# EasyEDA Pro project 51PCB_Project.eprj, board PCB1
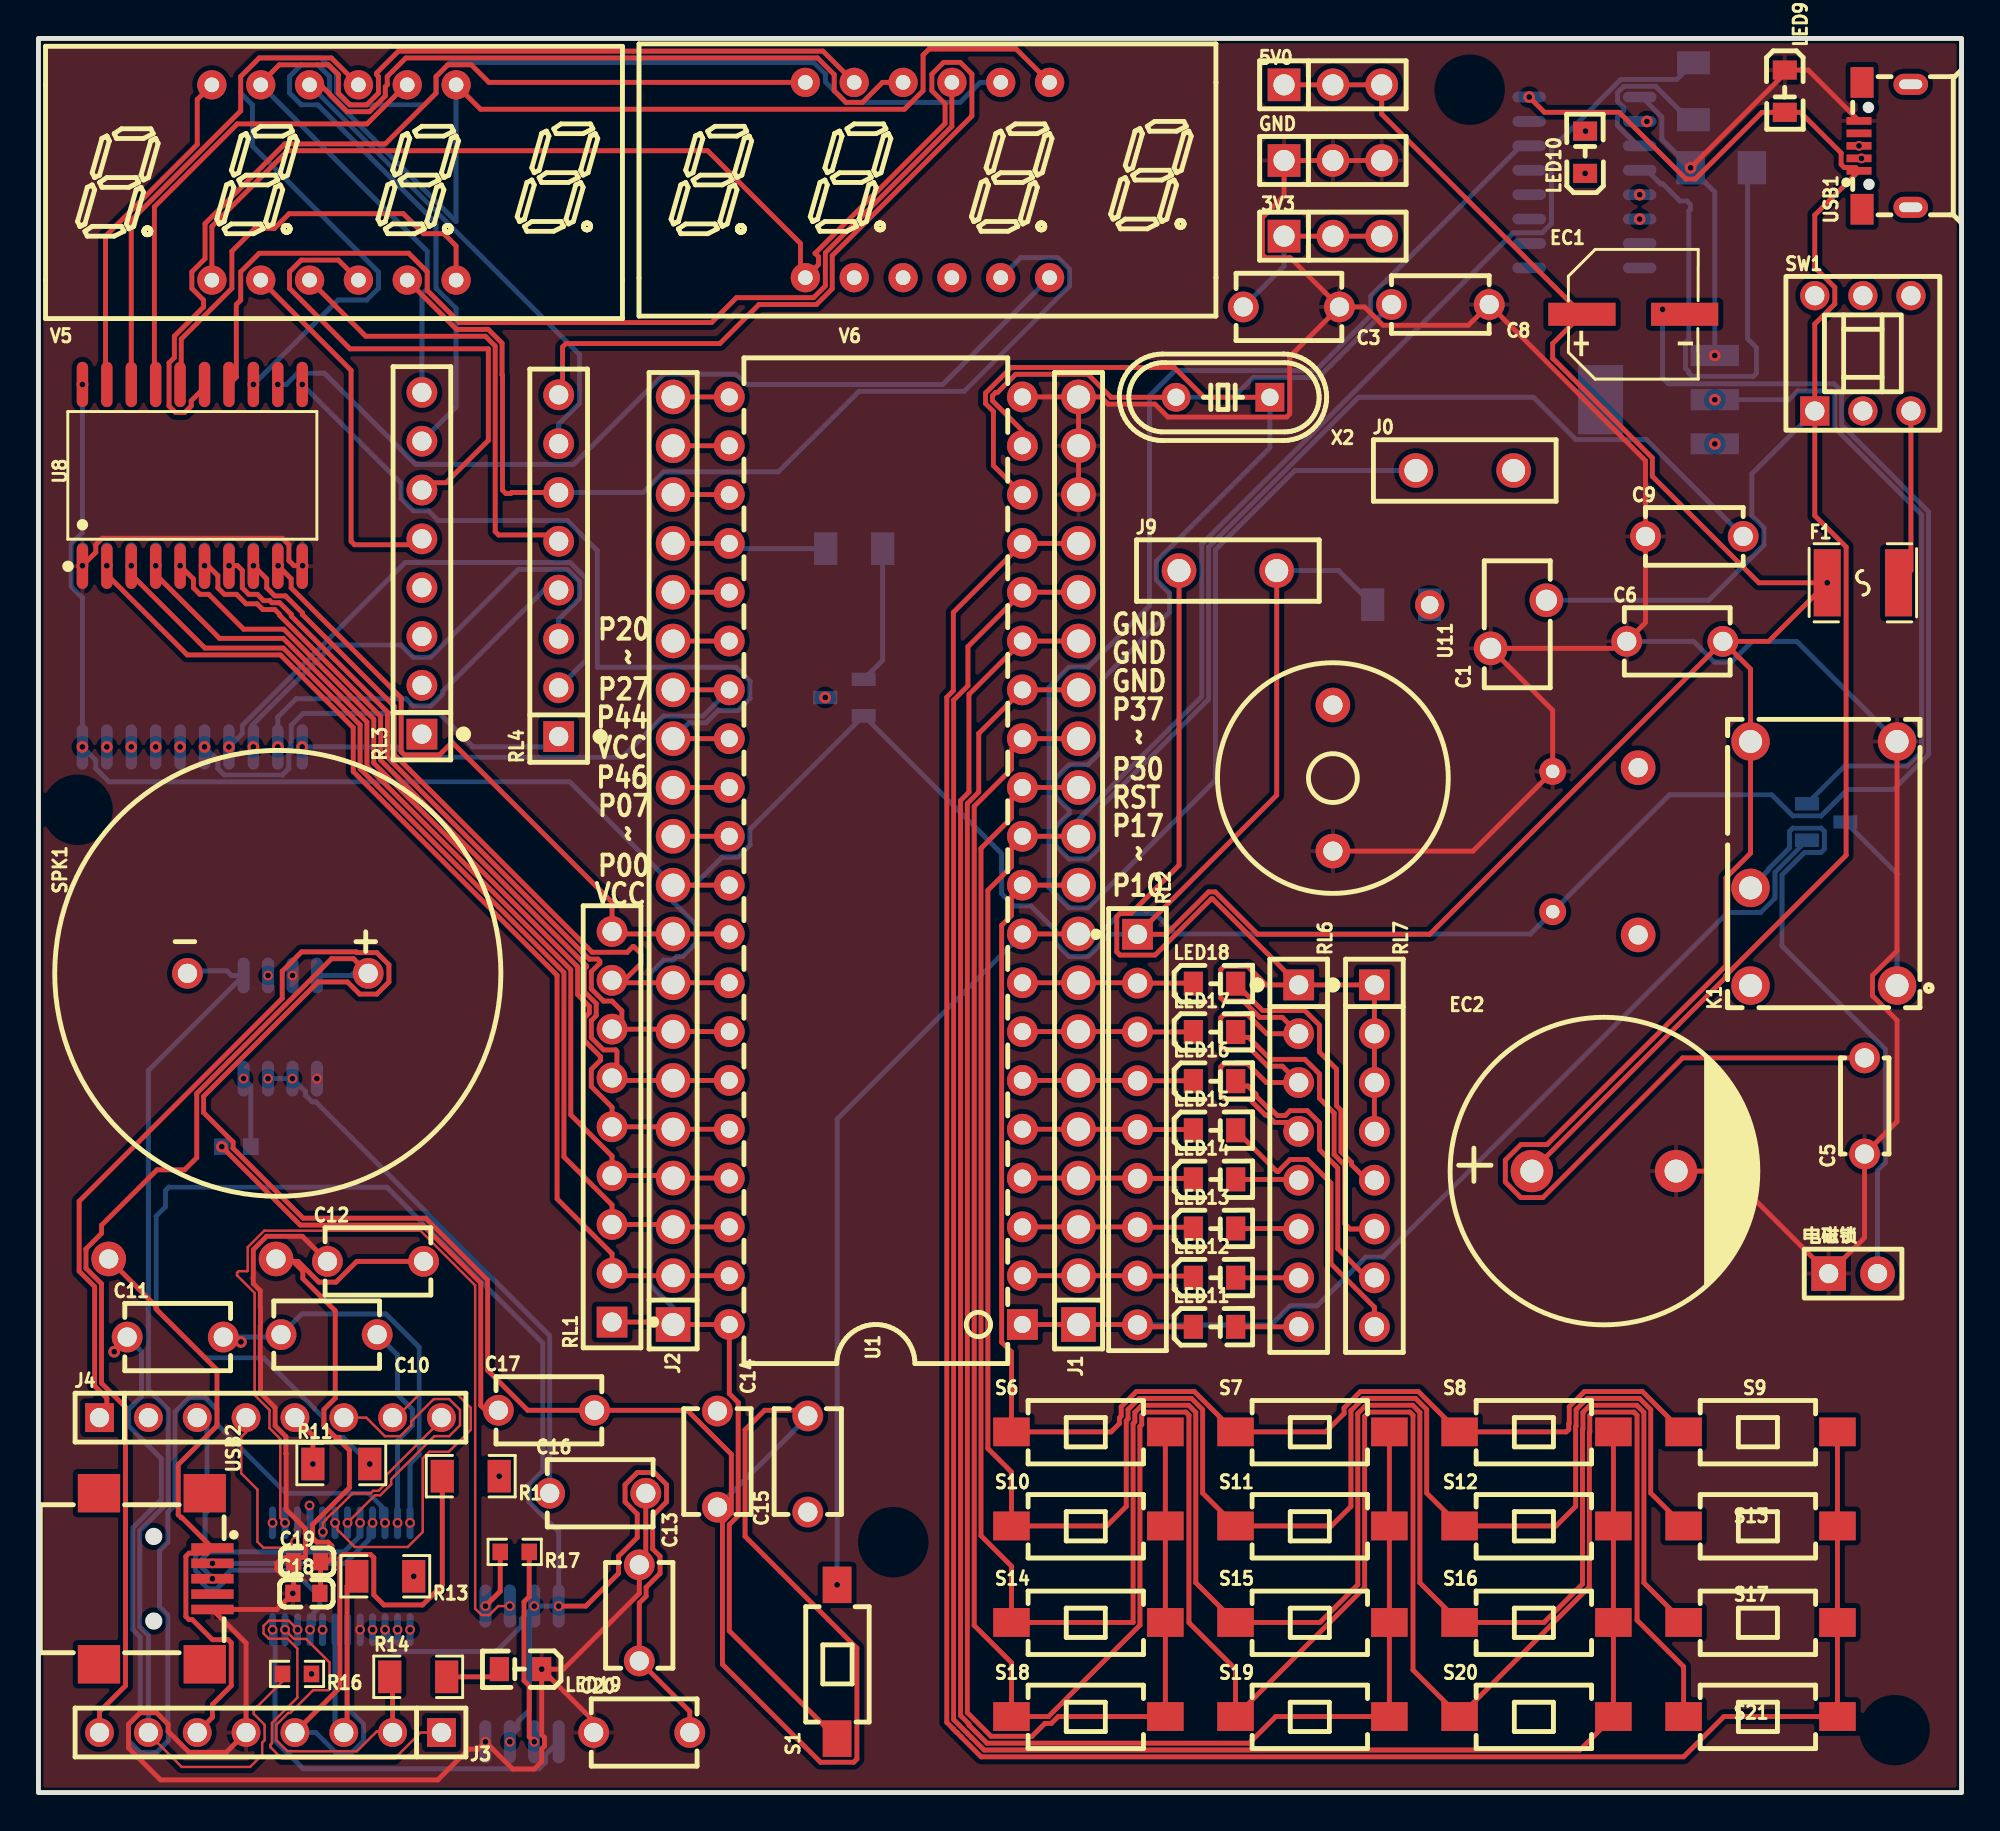
[diagram p1: board, top side]
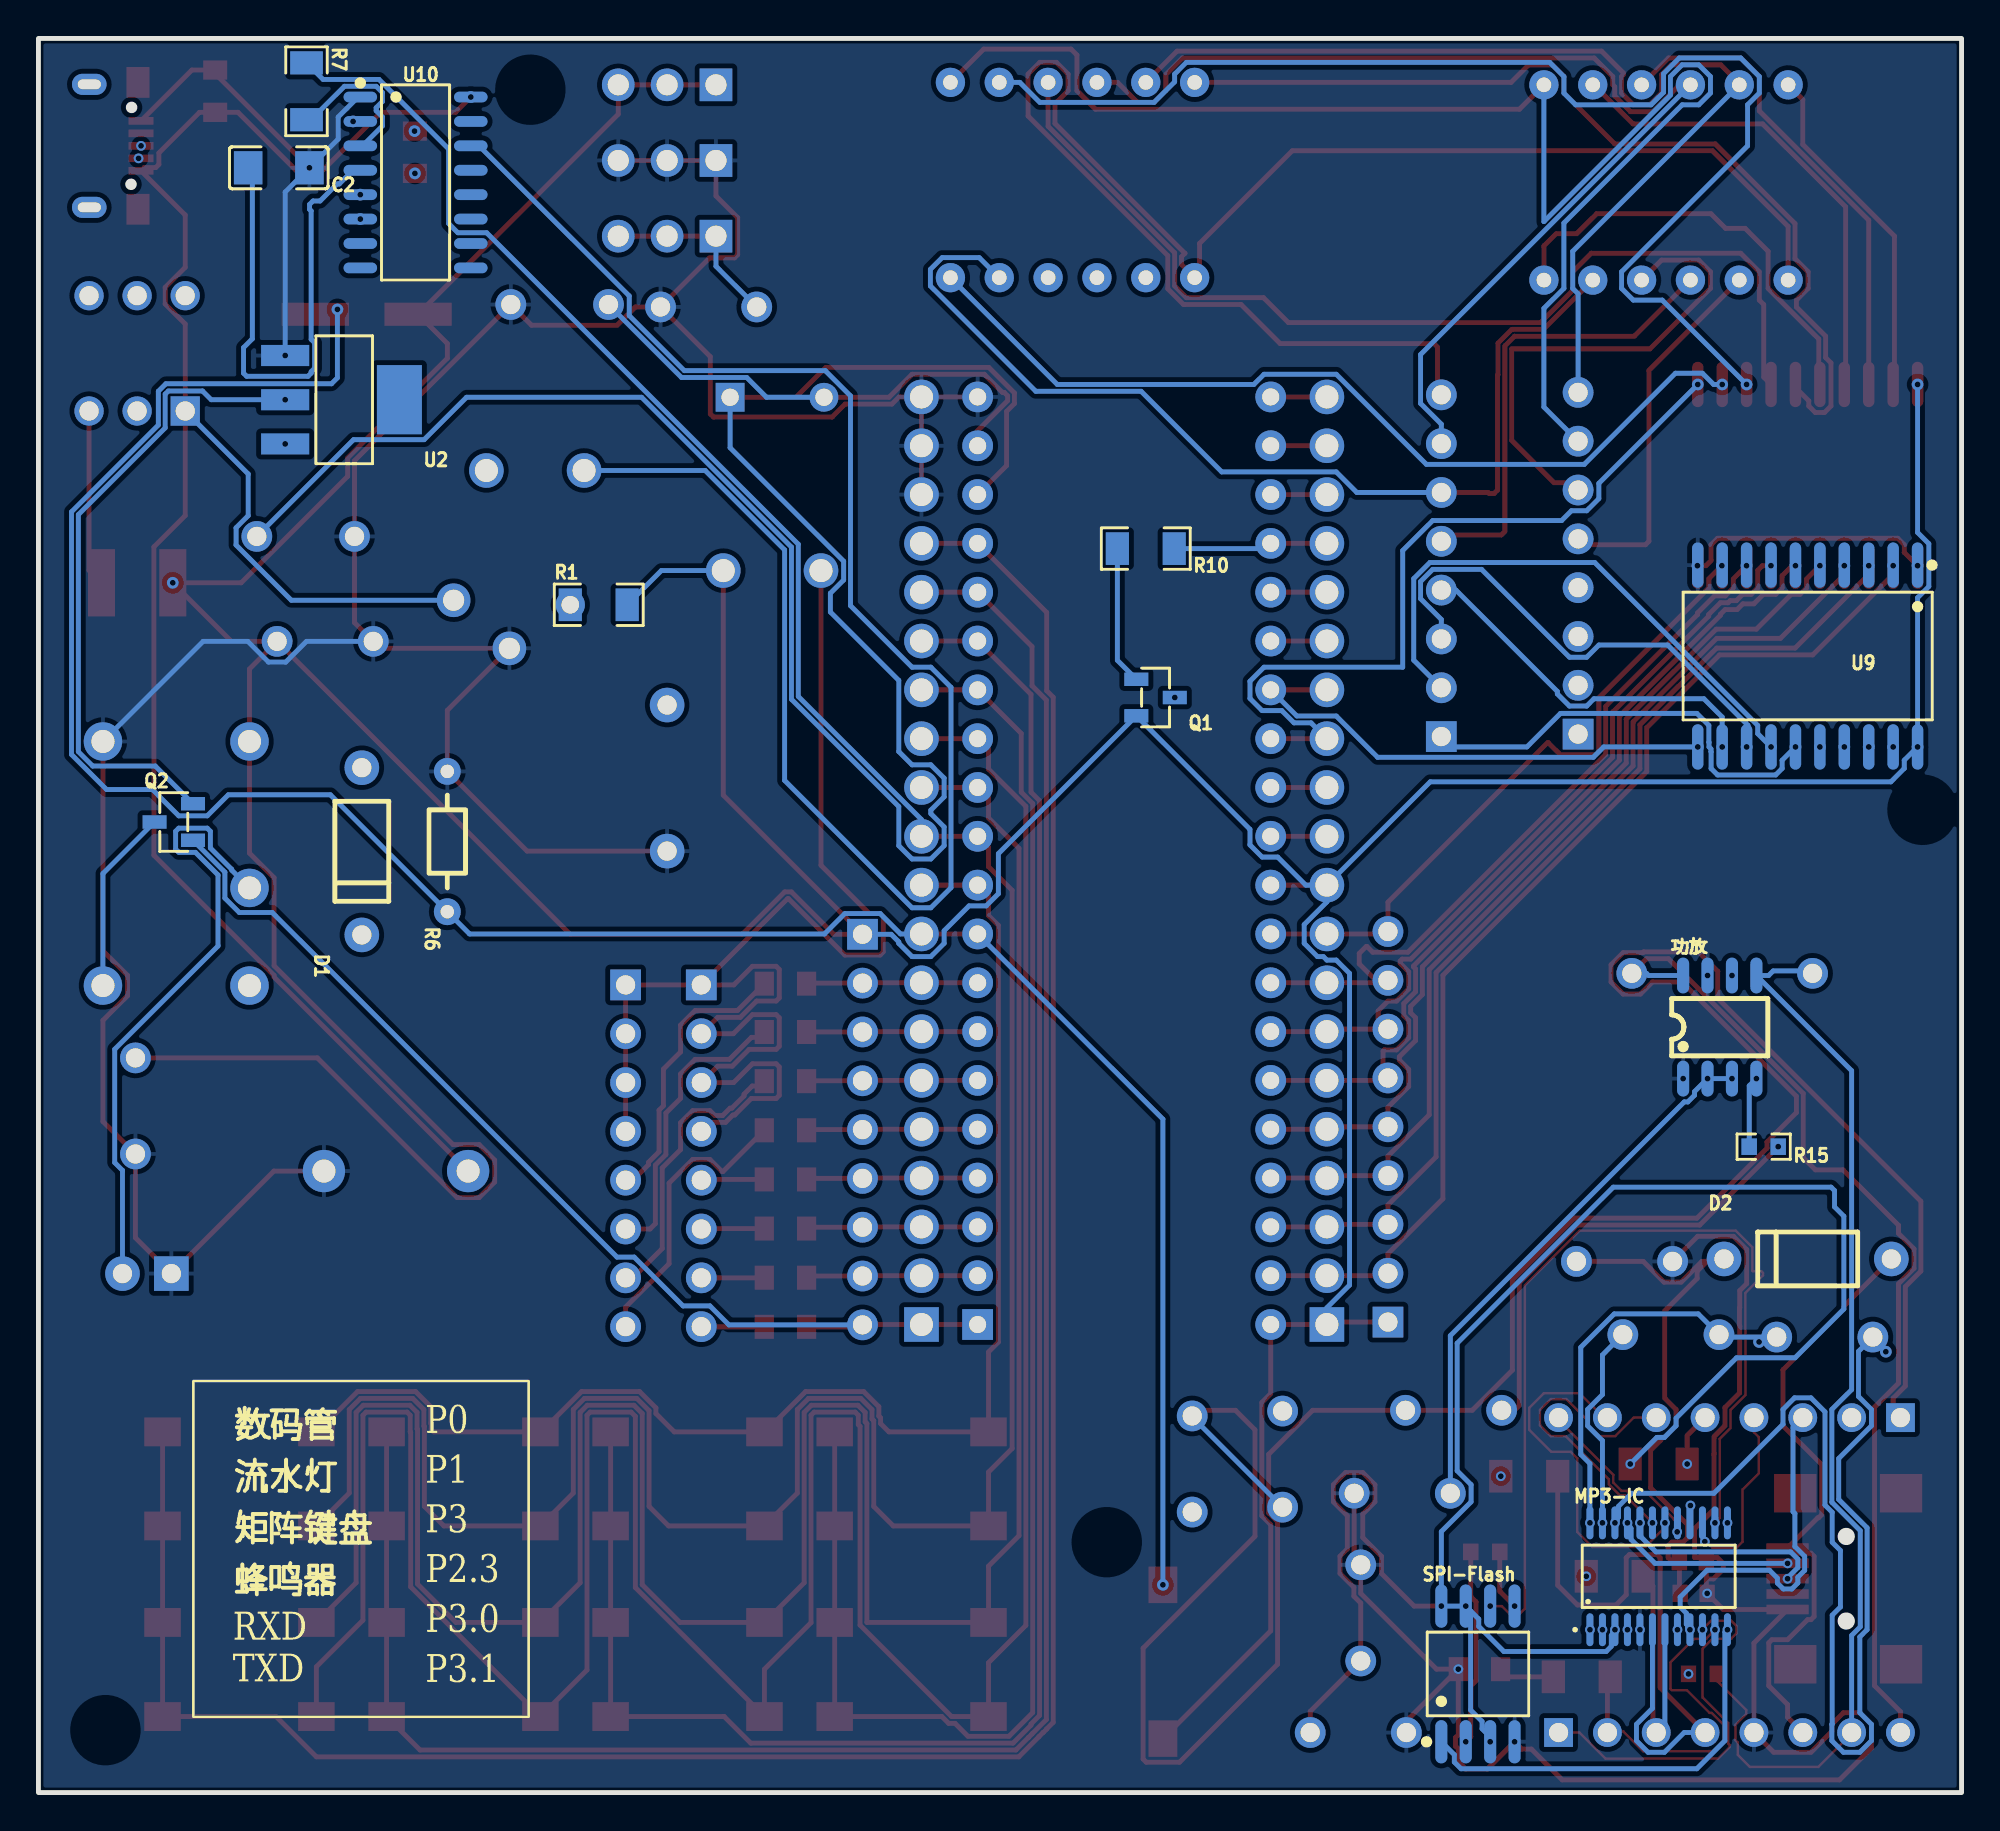
[diagram p2: board, bottom side, seen from below]

Outline 100 x 91.26 mm; copper layers: Top Layer, Inner1, Inner2, Bottom Layer. Coordinates in mm from the lower left corner of the outline.
Outline path: rectangle 0,91.26 100,0
Stack: Top Layer 0.035mm 外层铜厚1oz / Dielectric1 0.2104mm 7628 RC49% 8.6mil / Inner1 0.0152mm 内层铜厚 / Dielectric2 1.065mm 1.1mm H/HOZ Copper / Inner2 0.0152mm 内层铜厚 / Dielectric3 0.2104mm 7628 RC49% 8.6mil / Bottom Layer 0.035mm 外层铜厚1oz

## Design rules (mm)
template: 自定义配置
spacing copperThickness1oz (default): track to track 0.102, other pairs 0.127 to 0.3
spacing copperThickness2oz: track to track 0.203, other pairs 0.152 to 0.3
track width copperThickness1oz (default): min 0.127, default 0.254, max 2.54
track width copperThickness2oz: min 0.203, default 0.254, max 2.54
differential pair differentialPair (default): width min 0.127, default 0.254, max 2.54; gap min 0.152, default 0.152
via viaSize (default): diameter min 0.5, default 0.61, max 10; hole min 0.3, default 0.305, max 6.3

## Placement (name value [footprint] x y rotation side)
3V3  -  [HDR-TH_3P-P2.54-V-M]  67.31 80.98 0 top
5V0  -  [HDR-TH_3P-P2.54-V-M]  67.31 88.85 0 top
C1  100nF  [CAP-TH_L6.5-W3.5-P2.50-D0.6-S2.90]  76.96 60.78 90 top
C2  10nF  [C1206]  87.5 84.53 0 bottom
C3  1uF  [CAP-TH_L5.5-W3.5-P5.00-D1.2]  65.15 77.29 180 top
C5  100nF  [CAP-TH_L5.0-W2.5-P5.00-D1.0]  94.96 35.72 90 top
C6  1uF  [CAP-TH_L5.5-W3.5-P5.00-D1.2]  85.09 59.89 0 top
C8  30pF  [CAP-TH_L5.0-W3.0-P5.00-D1.0]  72.9 77.42 180 top
C9  30pF  [CAP-TH_L5.0-W3.0-P5.00-D1.0]  86.11 65.35 0 top
C10  1uF  [CAP-TH_L5.5-W3.5-P5.00-D1.2]  15.11 23.82 180 top
C11  1uF  [CAP-TH_L5.5-W3.5-P5.00-D1.2]  7.11 23.7 0 top
C12  1uF  [CAP-TH_L5.5-W3.5-P5.00-D1.2]  17.53 27.64 0 top
C13  1uF  [CAP-TH_L5.5-W3.5-P5.00-D1.2]  31.24 9.35 270 top
C14  1uF  [CAP-TH_L5.5-W3.5-P5.00-D1.2]  35.31 17.35 270 top
C15  1uF  [CAP-TH_L5.5-W3.5-P5.00-D1.2]  40 17.09 90 top
C16  1uF  [CAP-TH_L5.5-W3.5-P5.00-D1.2]  29.08 15.57 0 top
C17  1uF  [CAP-TH_L5.5-W3.5-P5.00-D1.2]  26.42 19.89 0 top
C18  100nF  [C0603]  13.93 10.36 0 top
C19  100nF  [C0603]  13.97 12.01 0 top
C20  1uF  [CAP-TH_L5.5-W3.5-P5.00-D1.2]  31.37 3.12 0 top
D1  -  [DO_1N4007]  83.19 48.97 90 bottom
D2  -  [DO_1N4007]  8 27.76 180 bottom
EC1  10uF  [CAP-SMD_BD6.3-L6.6-W6.6-LS7.2-FD]  82.93 76.91 0 top
EC2  470uF  [CAP-TH_BD16.0-P7.50-D1.2-FD]  81.41 32.33 0 top
F1  保险丝  [F1812]  94.87 62.94 0 top
GND  -  [HDR-TH_3P-P2.54-V-M]  67.31 84.91 0 top
J0  烧写跳线  [CONN-TH_D3086XX]  74.17 68.78 0 top
J1  -  [HDR-TH_20P-P2.54-V-M-1]  54.08 48.48 90 top
J2  -  [HDR-TH_20P-P2.54-V-M-1]  33 48.48 90 top
J3  -  [HDR-TH_8P-P2.54-V-M]  12.06 3.12 180 top
J4  -  [HDR-TH_8P-P2.54-V-M]  12.06 19.51 0 top
J9  流水灯跳线  [CONN-TH_D3086XX]  61.85 63.58 0 top
K1  继电器  [RELAY-TH_DS1E-S-DC24V]  92.84 48.34 90 top
LED9  电源指示灯  [LED_0805]  90.81 88.47 270 top
LED10  -  [LED_0805]  80.43 85.39 90 top
LED11  -  [LED_0805]  61.21 24.23 0 top
LED12  -  [LED_0805]  61.21 26.78 0 top
LED13  -  [LED_0805]  61.21 29.34 0 top
LED14  -  [LED_0805]  61.21 31.9 0 top
LED15  -  [LED_0805]  61.21 34.45 0 top
LED16  -  [LED_0805]  61.21 37.01 0 top
LED17  -  [LED_0805]  61.21 39.56 0 top
LED18  -  [LED_0805]  61.21 42.08 0 top
LED19  -  [LED_0805]  25.02 6.43 180 top
MP3-IC  JQ8900S  [TSSOP-24_L7.8-W4.4-P0.65-LS6.4-BL_1]  15.75 11.25 180 bottom
NOREF  -  [Pad_e4859]  72.34 61.8 0 top
Q1  S8550  [SOT-23-3_L2.9-W1.3-P1.90-LS2.4-BR]  41.91 56.97 0 bottom
Q2  S8550  [SOT-23-3_L2.9-W1.3-P1.90-LS2.4-BR]  92.96 50.5 180 bottom
R1  4.7kΩ  [R1206]  70.87 61.8 180 bottom
R6  4.7kΩ  [RES-TH_BD1.9-L3.3-P7.30-D0.5]  78.74 49.48 90 bottom
R7  300Ω  [R1206]  86.06 88.51 270 bottom
R10  1K  [R1206]  42.42 64.72 0 bottom
R11  300Ω  [R1206]  15.75 17.09 0 top
R12  300Ω  [R1206]  22.48 16.46 180 top
R13  300Ω  [R1206]  18.03 11.25 180 top
R14  300Ω  [R1206]  19.75 6.02 0 top
R15  20K  [R0603]  10.29 33.6 0 bottom
R16  47K  [R0603]  13.44 6.17 180 top
R17  100R  [R0603]  24.77 12.52 180 top
RL1  10kΩ  [RES-ARRAY-TH_9P-P2.54-D1.0]  29.83 34.64 90 top
RL2  10kΩ  [RES-ARRAY-TH_9P-P2.54-D1.0]  57.15 34.49 270 top
RL3  470Ω  [RES-ARRAY-TH_8P-P2.54-D1.0]  19.94 63.96 90 top
RL4  470Ω  [RES-ARRAY-TH_8P-P2.54-D1.0]  27.05 63.83 90 top
RL6  470Ω  [RES-ARRAY-TH_8P-P2.54-D1.0]  65.53 33.13 270 top
RL7  470Ω  [RES-ARRAY-TH_8P-P2.54-D1.0]  69.47 33.13 270 top
S1  TS-1101-C-W  [SW-SMD_L6.0-W3.3-LS8.0]  41.53 6.81 90 top
S6  TS-1101-C-W  [SW-SMD_L6.0-W3.3-LS8.0]  54.6 18.77 0 top
S7  TS-1101-C-W  [SW-SMD_L6.0-W3.3-LS8.0]  66.25 18.77 0 top
S8  TS-1101-C-W  [SW-SMD_L6.0-W3.3-LS8.0]  77.9 18.77 0 top
S9  TS-1101-C-W  [SW-SMD_L6.0-W3.3-LS8.0]  89.55 18.77 0 top
S10  TS-1101-C-W  [SW-SMD_L6.0-W3.3-LS8.0]  54.6 13.87 0 top
S11  TS-1101-C-W  [SW-SMD_L6.0-W3.3-LS8.0]  66.25 13.87 0 top
S12  TS-1101-C-W  [SW-SMD_L6.0-W3.3-LS8.0]  77.9 13.87 0 top
S13  TS-1101-C-W  [SW-SMD_L6.0-W3.3-LS8.0]  89.55 13.87 0 top
S14  TS-1101-C-W  [SW-SMD_L6.0-W3.3-LS8.0]  54.6 8.85 0 top
S15  TS-1101-C-W  [SW-SMD_L6.0-W3.3-LS8.0]  66.25 8.85 0 top
S16  TS-1101-C-W  [SW-SMD_L6.0-W3.3-LS8.0]  77.9 8.85 0 top
S17  TS-1101-C-W  [SW-SMD_L6.0-W3.3-LS8.0]  89.55 8.85 0 top
S18  TS-1101-C-W  [SW-SMD_L6.0-W3.3-LS8.0]  54.6 3.96 0 top
S19  TS-1101-C-W  [SW-SMD_L6.0-W3.3-LS8.0]  66.25 3.96 0 top
S20  TS-1101-C-W  [SW-SMD_L6.0-W3.3-LS8.0]  77.9 3.96 0 top
S21  TS-1101-C-W  [SW-SMD_L6.0-W3.3-LS8.0]  89.55 3.96 0 top
SPI-Flash  W25Q32JVSSIQ  [SOIC-8_L5.3-W5.3-P1.27-LS8.0-BL]  25.15 6.17 180 bottom
SPK1  FS-2308  [BEEP-TH_BD23.2-P9.20-D1.0]  12.45 42.62 0 top
SW1  电源开关  [SW-TH_6P-L8.0-W8.0-P2.50]  94.87 74.88 0 top
U1  STC89C52RC-40I-PDIP40  [DIP-40_L52.0-W13.7-P2.54-LS15.2-BL]  43.54 48.48 90 top
U2  AMS1117-3.3  [SOT-223-3_L6.5-W3.5-P3.05-LS7.0]  84.2 72.47 0 bottom
U8  74HC573S  [SOIC-20_L13.0-W7.6-P1.27-LS10.3-BL]  8 68.53 0 top
U9  74HC573S  [SOIC-20_L13.0-W7.6-P1.27-LS10.3-BL]  8 59.13 0 bottom
U10  CH340C  [SOP-16_L10.0-W3.9-P1.27-LS6.0-BL]  80.39 83.77 270 bottom
U11  2.6kHz  [BUZ-TH_BD12.0-P7.60-D0.6-FD]  67.31 52.78 270 top
USB1  MicroUSB-5PIN  [USB-SMD_5P_MICROUSB-5PIN]  96.01 85.67 90 top
USB2  -  [USB_MINI-5P]  6.1 11.12 270 top
V5  FJ3461AH  [LED-SEG-TH_12P-L30.0-W14.0-P2.54-S10.16-BL]  15.37 83.77 0 top
V6  FJ3461AH  [LED-SEG-TH_12P-L30.0-W14.0-P2.54-S10.16-BL]  46.23 83.9 0 top
X2  11.0592MHz  [HC-49US_L11.5-W4.5-P4.88]  61.59 72.59 180 top
功放  8002  [SOP-8_L4.9-W3.9-P1.27-LS6.0-BL]  12.57 39.83 180 bottom
电磁锁  -  [HDR-TH_2P-P2.54-V-M-1]  94.36 27 0 top

## Footprints (pads in the part's own frame, mm; a bottom-side part is the same pattern mirrored in y, then rotated)
BEEP-TH_BD23.2-P9.20-D1.0
  round 1.6 hole 1: 1(4.7,0) 2(-4.7,0)
BUZ-TH_BD12.0-P7.60-D0.6-FD
  round 1.8 hole 1: 1(-3.8,0) 2(3.8,0)
C0603
  rect 0.8x0.9 smd: 1(-0.7,0) 2(0.7,0)
C1206
  rect 1.485x1.728 smd: 1(-1.593,0) 2(1.593,0)
CAP-SMD_BD6.3-L6.6-W6.6-LS7.2-FD
  rect 3.5x1.2 smd: 1(-2.67,0) 2(2.67,0)
CAP-TH_BD16.0-P7.50-D1.2-FD
  round 2.2 hole 1.2: 1(-3.75,0) 2(3.75,0)
CAP-TH_L5.0-W2.5-P5.00-D1.0
  round 1.6 hole 1: 1(-2.5,0) 2(2.5,0)
CAP-TH_L5.0-W3.0-P5.00-D1.0
  round 1.6 hole 1: 1(-2.54,0) 2(2.54,0)
CAP-TH_L5.5-W3.5-P5.00-D1.2
  round 1.6 hole 1: 1(-2.5,0) 2(2.5,0)
CAP-TH_L6.5-W3.5-P2.50-D0.6-S2.90
  round 1.75 hole 1.1: 1(-1.25,1.45) 2(1.25,-1.45)
CONN-TH_D3086XX
  round 1.8 hole 1.2: 1(-2.54,0) 2(2.54,0)
DIP-40_L52.0-W13.7-P2.54-LS15.2-BL
  rect 1.6x1.6 hole 0.889: 1(-24.13,-7.62)
  round 1.6 hole 0.889: 2(-21.59,-7.62) 3(-19.05,-7.62) 4(-16.51,-7.62) 5(-13.97,-7.62) 6(-11.43,-7.62) 7(-8.89,-7.62) 8(-6.35,-7.62) 9(-3.81,-7.62) 10(-1.27,-7.62) 11(1.27,-7.62) 12(3.81,-7.62) 13(6.35,-7.62) 14(8.89,-7.62) 15(11.43,-7.62) 16(13.97,-7.62) 17(16.51,-7.62) 18(19.05,-7.62) 19(21.59,-7.62) 20(24.13,-7.62) 21(24.13,7.62) 22(21.59,7.62) 23(19.05,7.62) 24(16.51,7.62) 25(13.97,7.62) 26(11.43,7.62) 27(8.89,7.62) 28(6.35,7.62) 29(3.81,7.62) 30(1.27,7.62) 31(-1.27,7.62) 32(-3.81,7.62) 33(-6.35,7.62) 34(-8.89,7.62) 35(-11.43,7.62) 36(-13.97,7.62) 37(-16.51,7.62) 38(-19.05,7.62) 39(-21.59,7.62) 40(-24.13,7.62)
DO_1N4007
  round 1.8 hole 1: 1(-4.35,0) 2(4.35,0)
F1812
  rect 1.407x3.499 smd: 1(-1.853,0) 2(1.853,0)
HC-49US_L11.5-W4.5-P4.88
  rect 1.5x1.5 hole 0.9: 1(-2.44,0)
  round 1.5 hole 0.9: 2(2.44,0)
HDR-TH_2P-P2.54-V-M-1
  rect 1.8x1.8 hole 1: 1(-1.27,0)
  round 1.8 hole 1: 2(1.27,0)
HDR-TH_3P-P2.54-V-M
  rect 1.7x1.7 hole 1.1: 1(-2.54,0)
  round 1.7 hole 1.1: 2(0,0) 3(2.54,0)
HDR-TH_8P-P2.54-V-M
  rect 1.5x1.5 hole 1: 1(-8.89,0)
  round 1.5 hole 1: 2(-6.35,0) 3(-3.81,0) 4(-1.27,0) 5(1.27,0) 6(3.81,0) 7(6.35,0) 8(8.89,0)
HDR-TH_20P-P2.54-V-M-1
  rect 1.8x1.8 hole 1.2: 1(-24.13,0)
  round 1.8 hole 1.2: 2(-21.59,0) 3(-19.05,0) 4(-16.51,0) 5(-13.97,0) 6(-11.43,0) 7(-8.89,0) 8(-6.35,0) 9(-3.81,0) 10(-1.27,0) 11(1.27,0) 12(3.81,0) 13(6.35,0) 14(8.89,0) 15(11.43,0) 16(13.97,0) 17(16.51,0) 18(19.05,0) 19(21.59,0) 20(24.13,0)
LED-SEG-TH_12P-L30.0-W14.0-P2.54-S10.16-BL
  round 1.524 hole 0.762: 1(-6.35,-5.08) 2(-3.81,-5.08) 3(-1.27,-5.08) 4(1.27,-5.08) 5(3.81,-5.08) 6(6.35,-5.08) 7(6.35,5.08) 8(3.81,5.08) 9(1.27,5.08) 10(-1.27,5.08) 11(-3.81,5.08) 12(-6.35,5.08)
LED_0805
  rect 1x1.25 smd: 1(-1.15,0.005) 2(1.05,0.005)
Pad_e4859
  round 1.524 hole 0.914: 1(0,0)
R0603
  rect 0.806x0.864 smd: 1(-0.753,0) 2(0.753,0)
R1206
  rect 1.208x1.701 smd: 1(-1.479,0) 2(1.479,0)
RELAY-TH_DS1E-S-DC24V
  round 2 hole 1.2: 1(-6.35,-3.81) 6(6.35,-3.81) 7(6.35,3.81) 10(-1.27,3.81) 12(-6.35,3.81)
RES-ARRAY-TH_8P-P2.54-D1.0
  rect 1.6x1.6 hole 1: 1(-8.89,0)
  round 1.6 hole 1: 2(-6.35,0) 3(-3.81,0) 4(-1.27,0) 5(1.27,0) 6(3.81,0) 7(6.35,0) 8(8.89,0)
RES-ARRAY-TH_9P-P2.54-D1.0
  rect 1.6x1.6 hole 1: 1(-10.16,0)
  round 1.6 hole 1: 2(-7.62,0) 3(-5.08,0) 4(-2.54,0) 5(0,0) 6(2.54,0) 7(5.08,0) 8(7.62,0) 9(10.16,0)
RES-TH_BD1.9-L3.3-P7.30-D0.5
  round 1.4 hole 0.7: 1(-3.65,0) 2(3.65,0)
SOIC-8_L5.3-W5.3-P1.27-LS8.0-BL
  oval 0.63x2.25 smd: 1(-1.905,-3.53) 2(-0.635,-3.53) 3(0.635,-3.53) 4(1.905,-3.53) 5(1.905,3.53) 6(0.635,3.53) 7(-0.635,3.53) 8(-1.905,3.53)
SOIC-20_L13.0-W7.6-P1.27-LS10.3-BL
  oval 0.595x2.36 smd: 1(-5.715,-4.73) 2(-4.445,-4.73) 3(-3.175,-4.73) 4(-1.905,-4.73) 5(-0.635,-4.73) 6(0.635,-4.73) 7(1.905,-4.73) 8(3.175,-4.73) 9(4.445,-4.73) 10(5.715,-4.73) 11(5.715,4.73) 12(4.445,4.73) 13(3.175,4.73) 14(1.905,4.73) 15(0.635,4.73) 16(-0.635,4.73) 17(-1.905,4.73) 18(-3.175,4.73) 19(-4.445,4.73) 20(-5.715,4.73)
SOP-8_L4.9-W3.9-P1.27-LS6.0-BL
  oval 0.63x1.865 smd: 1(-1.905,-2.683) 2(-0.635,-2.683) 3(0.635,-2.683) 4(1.905,-2.683) 5(1.905,2.683) 6(0.635,2.683) 7(-0.635,2.683) 8(-1.905,2.683)
SOP-16_L10.0-W3.9-P1.27-LS6.0-BL
  oval 0.56x1.745 smd: 1(-4.445,-2.873) 2(-3.175,-2.873) 3(-1.905,-2.873) 4(-0.635,-2.873) 5(0.635,-2.873) 6(1.905,-2.873) 7(3.175,-2.873) 8(4.445,-2.873) 9(4.445,2.873) 10(3.175,2.873) 11(1.905,2.873) 12(0.635,2.873) 13(-0.635,2.873) 14(-1.905,2.873) 15(-3.175,2.873) 16(-4.445,2.873)
SOT-23-3_L2.9-W1.3-P1.90-LS2.4-BR
  rect 1.25x0.7 smd: 1(1,-0.95) 2(1,0.95) 3(-1,0)
SOT-223-3_L6.5-W3.5-P3.05-LS7.0
  rect 2.5x1.1 smd: 1(2.97,-2.3) 2(2.97,0) 3(2.97,2.3)
  rect 2.34x3.6 smd: 4(-2.97,0)
SW-SMD_L6.0-W3.3-LS8.0
  rect 1.9x1.5 smd: 1(-4,0) 2(4,0)
SW-TH_6P-L8.0-W8.0-P2.50
  rect 1.524x1.524 hole 1: 1(-2.5,-3)
  round 1.524 hole 1: 2(0,-3) 3(2.5,-3) 4(-2.5,3) 5(0,3) 6(2.5,3)
TSSOP-24_L7.8-W4.4-P0.65-LS6.4-BL_1
  oval 0.364x1.71 smd: 1(-3.575,-2.78) 2(-2.925,-2.78) 3(-2.275,-2.78) 4(-1.625,-2.78) 5(-0.975,-2.78) 6(-0.325,-2.78) 7(0.325,-2.78) 8(0.975,-2.78) 9(1.625,-2.78) 10(2.275,-2.78) 11(2.925,-2.78) 12(3.575,-2.78) 13(3.575,2.78) 14(2.925,2.78) 15(2.275,2.78) 16(1.625,2.78) 17(0.975,2.78) 18(0.325,2.78) 19(-0.325,2.78) 20(-0.975,2.78) 21(-1.625,2.78) 22(-2.275,2.78) 23(-2.925,2.78) 24(-3.575,2.78)
USB-SMD_5P_MICROUSB-5PIN
  rect 0.4x1.3 smd: 1(-1.3,1.345) 2(-0.65,1.345) 3(0,1.345) 4(0.65,1.345) 5(1.3,1.345)
  rect 1.6x1.2 smd: 6(3.3,1.185) 7(-3.3,1.185)
  oval 1.1x1.8 hole 0.5x1.2: 8(3.2,-1.345) 9(-3.2,-1.345)
USB_MINI-5P
  rect 0.5x2.2 smd: 1(-1.6,2.95) 2(-0.8,2.95) 3(0,2.95) 4(0.8,2.95) 5(1.6,2.95)
  rect 2x2.2 smd: 6(-4.45,2.55) 7(4.45,2.55) 8(4.45,-2.95) 9(-4.45,-2.95)

## Nets
As in the schematic, except:
$1N8914: LED10.2 NOREF.1 R1.1

Pads without a net: J0 2; K1 12; SW1 2 4 5 6; U2 4; U10 7 8 9 10 11 12 13 15; USB1 4 6 7 8 9; USB2 4 6 7 8 9

## Via types
v1: diameter 0.61, hole 0.305, Top Layer to Bottom Layer, 41 vias
v2: diameter 0.508, hole 0.305, Top Layer to Bottom Layer, 46 vias

## Routing (per net, layer and track width the routed paths; a pad name or vN(x,y) marks a point on that pad's centre or on a via; arc(x,y) is an arc through that point)
AGND: length 20.7
  Bottom Layer w0.254: C11.2 12.49,23.7 C10.2 13.69,24.9 18.06,24.9 19.8,23.16 19.8,17.59 19.32,17.12 v2(19.32,14.03)
  vias: v1(10.53,23.44)
GND: length 398.7
  Top Layer w0.254: K1.6 96.65,43.8 95.37,42.52 95.37,41.46 96.65,40.18 96.65,34.91 C5.1 94.96,28.87 93.09,27 87.76,32.33 EC2.2 ; J1.20 55.25,72.61 55.62,72.24 58.06,72.24 58.73,71.56 64.9,71.56 65.06,71.73 65.06,74.7 C3.1 ; J1.20 U1.20 ; J1.20 J1.19 J1.18 ; GND.3 GND.2 GND.1 64.77,83.07 63.64,81.94 63.64,80.01 63.8,79.85 65.1,79.85 C3.1 ; v2(26.17,6.42) 27.3,6.42 31.24,10.36 C13.1 31.58,12.19 C16.2 ; v2(26.17,6.42) 26.17,3.01 26.31,2.86 26.31,2.42 26.17,2.28 26.17,1.61 25.78,1.22 24.66,1.22 v2(23.24,2.64) 22.86,2.26 22.37,2.26 20.77,0.66 6.34,0.66 4.69,2.32 4.69,3.55 5.29,4.15 6.14,4.15 6.74,3.55 6.74,3.18 7.83,2.09 9.77,2.09 J3.5 10.8,7.78 USB2.5 12.39,9.53 v2(13.23,10.36) 13.27,10.4 13.27,11.12 ; v2(26.17,6.42) 28.87,3.72 C20.1 ; v1(2.29,63.83) 2.98,64.52 2.98,64.92 3.32,65.26 12.69,65.26 13.02,64.92 13.02,64.1 13.29,63.83 v1(13.73,63.83) ; C3.1 68.96,77.29 69.91,76.34 74.36,76.34 C8.1 83.57,69.29 C9.1 83.57,60.87 C6.1 82.23,59.53 C1.1 78.74,56.3 R6.2 74.59,48.98 U11.2 ; 13.27,11.12 C19.1 ; 13.27,11.12 13.26,11.12 12.9,11.12 12.39,11.62 12.39,11.92 12.7,12.23 13.88,12.23 13.88,13.73 12.88,14.73 12.88,17.62 12.87,17.63 12.87,18.52 12.31,19.08 12.31,20.03 11.55,20.79 11.55,22.48 11.53,22.49 11.53,24.27 11.55,24.28 11.55,25.22 11.53,25.23 11.53,26.11 11.17,26.48 11.17,28.25 11.86,28.94 13.72,28.94 C12.1 ; USB1.5 92.02,89.62 LED9.1 90.81,89.43 v1(85.91,84.53)
  Inner1 w0.254: C12.1 15.03,36.6 v2(14.48,37.14) 14.48,41.24 v2(13.21,42.51) 13.73,43.03 13.73,43.4 2.97,54.16 2.97,54.64 3.31,54.98 4.25,54.98 7.61,58.34 8.25,58.34 v1(13.73,63.83) 32.5,63.83 32.51,63.81 33.49,63.81 33.51,63.83 42.38,63.83 U1.20 ; v1(87.17,74.77) 85.72,74.77 83.79,72.84 83.79,72.35 84.38,71.77 84.38,69.09 83.57,68.28 C9.1 ; v2(13.23,10.36) 13.23,10.28 11.64,8.69 11.64,8.25 11.95,7.94 14.99,7.94 15.53,8.47 v2(16.72,8.47)
  Bottom Layer w0.254: C6.1 86.06,59.89 87.14,58.81 88.04,58.81 89.12,59.89 91.44,59.89 K1.6 ; v1(87.17,74.77) 87.17,83.27 v1(85.91,84.53) 84.41,86.03 84.41,87.18 83.38,88.21 U10.1
VCC: length 414.2
  Top Layer w0.254: D2.2 6.12,25.29 6.12,25.16 9.28,21.99 9.28,19.08 7.27,17.06 7.27,14.46 7.43,14.3 7.47,14.3 USB2.1 8.77,12.45 7.83,12.45 7.67,12.29 7.67,9.16 7.83,9 8,9 9.05,7.95 9.86,7.95 10.02,7.79 10.02,5.56 9.05,4.58 9.05,3.91 J3.6 ; C6.2 89.03,58.46 K1.7 89.03,48.88 87.75,47.6 87.75,43.02 78.44,33.71 77.09,33.71 76.28,32.91 76.28,31.76 77.09,30.95 78.23,30.95 85.5,38.22 C5.2 ; C6.2 72.35,44.65 63.4,44.65 61.2,46.86 60.85,46.86 58.64,44.65 RL2.1 64.39,51.89 J9.2 ; C6.2 89.97,59.89 v1(93.02,62.94) 89.46,62.94 83.92,68.48 83.92,69.44 78.74,74.62 78.74,75.39 80.26,76.91 69.85,87.32 5V0.3 5V0.2 5V0.1 ; RL1.1 32.88,24.48 J2.1 U1.40 35.92,20.76 36.38,20.3 36.38,14.4 35.92,13.94 35.92,8.41 S1.1 ; J2.10 U1.31
  Inner1 w0.254: v1(93.02,62.94) 93.02,64.32 v1(87.17,70.17) ; RL1.1 24.71,24.48 20.47,28.71 19.58,28.71 15.34,24.48 13.49,24.48 11.02,26.94 11.02,36.75 11.2,36.92 11.2,37.37 10.89,37.68 10.45,37.68 10.13,37.37 10.13,36.92 10.31,36.75 10.31,27.85 10.22,27.76 D2.2
  Bottom Layer w0.254: J2.1 33,25.22 31.82,26.4 31.82,42.62 32.51,43.31 33,43.31 33.18,43.49 33.49,43.49 34.18,44.18 34.18,45.16 33,46.34 J2.10 ; 69.39,61.8 67.61,63.58 J9.2 ; v1(2.29,73.26) 2.29,65.56 1.7,64.97 1.7,62.75 2.29,62.16 v1(2.29,54.4) 2.98,53.71 2.98,53.28 3.67,52.59 27.63,52.59 J2.10 ; J2.10 34.1,47.21 35.56,48.67 36.37,48.67 37,49.3 37,50.11 Q1.2 50.08,48.85 50.08,46.76 50.72,46.13 51.61,46.13 52.91,44.84 52.91,44.18 53.6,43.49 54.57,43.49 55.26,44.18 55.26,44.26 55.66,44.65 RL2.1
3.3: length 103.7
  Top Layer w0.254: C20.2 33.87,4.22 C13.2 31.24,9.86 31.6,10.22 31.6,10.68 32.32,11.4 32.32,12.29 31.94,12.68 31.94,14.4 32.66,15.12 32.66,16.02 32.03,16.65 31.14,16.65 30.5,16.02 30.5,15.12 31.14,14.49 31.14,13.27 30.16,12.29 30.16,11.4 28.47,9.7 v2(27.05,9.7)
  Bottom Layer w0.254: v2(18.02,8.47) 18.14,8.35 18.14,8.25 18.21,8.18 18.21,7.61 18.48,7.34 23.8,7.34 25.11,8.65 25.11,9.03 25.53,9.45 ; 25.53,9.45 25.53,4.29 24.93,3.7 24.93,3.32 24.51,2.9 v2(24.51,2.64) ; 25.53,9.45 v2(25.78,9.7) v2(27.05,9.7) 27.05,13.58 25.5,15.12 25.5,16.02 26.23,16.74 26.23,23.38 18.11,31.5 6.78,31.5 6.6,31.32 6.6,30.47 6.12,29.99 6.12,25.16 8.66,22.62 11.7,22.62 14.85,19.47 14.85,19.08 15.45,18.48 15.84,18.48 v2(17.23,17.09)
+3.3: length 66.9
  Top Layer w0.254: 3V3.3 3V3.2 3V3.1
  Inner1 w0.254: v1(87.17,72.47) 87.17,72.79 87.53,73.14 87.53,74.3 87.75,74.52 87.75,75.01 87.41,75.35 84.29,75.35 78.66,80.98 3V3.3
  Bottom Layer w0.254: C3.2 64.77,79.41 3V3.1 ; Q2.2 93.93,53.41 97.18,53.41 97.93,54.16 97.93,66.49 93.41,71 93.41,72.76 93.25,72.92 91.47,72.92 91.02,72.47 v1(87.17,72.47)
A: length 55
  Top Layer w0.254: V5.11 11.56,88.92 12.52,89.89 15.09,89.89 15.6,89.38 15.6,88.42 16.21,87.81 17.07,87.81 17.68,88.42 17.68,89.28 17.59,89.37 17.59,89.47 18.72,90.6 40.79,90.6 V6.11
  Bottom Layer w0.254: V5.11 20.22,80.19 20.22,78.26 19.94,77.98 RL3.8
B: length 78.3
  Top Layer w0.254: V6.7 50.85,90.71 46.31,90.71 46,90.4 46,88.55 45.03,87.58 22.99,87.58 V5.7
  Bottom Layer w0.254: RL3.7 21.72,72.09 21.72,77.22 20.68,78.26 20.68,81.66 14.53,87.81 13.67,87.81 13.06,88.42 13.06,89.28 13.67,89.89 14.53,89.89 15.14,89.28 15.14,88.31 21.72,81.73 V5.7
BUSY: length 18.4
  Top Layer w0.127: v2(12.82,8.47) 13,8.29 13,8.28 13.29,7.99 13.91,7.99 15.13,6.77 15.13,5.39 15.07,5.33 14.28,5.33 13.1,4.14 12.99,4.14 12.37,3.52 12.37,2.72 12.94,2.16 13.15,2.16 13.16,2.15 16.55,2.15 17.58,3.18 18.36,3.18 J3.2
  Top Layer w0.254: J3.2 18.41,5.88 R14.1
C: length 58.2
  Top Layer w0.254: V5.4 15.6,79.73 13.67,79.73 13.06,79.12 13.06,78.26 16.2,75.11 23.39,75.11 23.39,70.35 21.19,68.15 20.32,68.15 RL3.6
  Inner1 w0.254: V6.4 46.43,78.82 45.03,77.42 29.59,77.42 RL3.6
D: length 52
  Top Layer w0.254: V5.2 16.26,73.99 16.26,65.1 16.44,64.92 19.63,64.92 RL3.5
  Inner1 w0.254: V6.2 41.35,78.82 40.31,77.78 24.1,77.78 22.15,79.73 13.67,79.73 12.75,78.82 11.68,78.82 V5.2
D0: length 56.7
  Top Layer w0.254: v1(3.56,63.83) 3.56,63.37 7.74,59.19 12.58,59.19 16.37,55.41 16.37,53.12 26.97,42.52 26.97,30.89 29.83,28.03 RL1.2 29.95,26.89 J2.2 U1.39
D1: length 53.2
  Top Layer w0.254: v1(4.83,63.83) 4.83,63.37 8.65,59.54 12.73,59.54 16.72,55.55 16.72,53.27 27.32,42.67 27.32,33.08 29.83,30.57 RL1.3 32.88,29.56 J2.3 U1.38
D2: length 49.7
  Top Layer w0.254: v1(6.1,63.83) 6.1,63.37 9.42,60.05 12.73,60.05 17.08,55.7 17.08,53.41 27.68,42.81 27.68,35.26 29.83,33.11 RL1.4 32.88,32.1 J2.4 U1.37
D3: length 46.7
  Top Layer w0.254: U1.36 J2.5 32.88,34.64 RL1.5 29.83,35.65 28.75,36.73 28.75,37.62 29.23,38.11 29.23,38.28 28.39,39.12 28.39,40.31 28.65,40.57 28.65,40.91 28.04,41.52 28.04,42.96 17.44,53.56 17.44,55.85 12.76,60.53 10.67,60.53 8.86,62.34 8.4,62.34 8.06,62.68 8.06,63.14 v1(7.37,63.83)
D4: length 43.6
  Top Layer w0.254: v1(8.64,63.83) 8.81,63.83 9.33,63.31 9.33,62.68 9.67,62.34 10.3,62.34 10.8,61.85 11.37,61.85 11.67,61.55 12.29,61.55 12.54,61.3 12.54,61.25 17.79,56 17.79,53.71 28.49,43.01 28.49,42.95 28.39,42.85 28.39,41.66 29,41.05 29,40.42 28.75,40.16 28.75,39.27 29.38,38.64 30.02,38.64 30.08,38.57 30.08,37.43 RL1.6 29.95,37.05 J2.6 U1.35
D5: length 40.7
  Top Layer w0.254: RL1.7 30.08,39.72 ; 30.08,39.72 30.34,39.97 30.34,40.67 29.82,41.18 29.38,41.18 28.75,41.81 28.75,42.7 29.19,43.15 29.19,43.26 29.09,43.36 28.64,43.36 18.15,53.86 18.15,56.21 13.15,61.21 13.15,61.29 12.54,61.9 12.14,61.9 12.03,62.01 11.71,62.01 11.38,62.34 10.94,62.34 10.6,62.68 10.6,63.59 10.36,63.83 v1(9.91,63.83) ; 30.08,39.72 32.88,39.72 J2.7 U1.34
D6: length 39.1
  Top Layer w0.254: U1.33 J2.8 29.95,42.13 RL1.8 30.46,42.26 31.32,43.12 31.32,43.65 30.96,44.02 30.91,44.02 30.62,43.72 28.79,43.72 18.5,54 18.5,56.51 13.73,61.29 13.73,61.38 12.84,62.26 12.29,62.26 11.87,62.68 11.87,63.14 v1(11.18,63.83)
D7: length 34.7
  Top Layer w0.254: v1(12.46,63.83) 13.14,63.15 13.14,62.68 18.86,56.96 18.86,54.15 19.02,53.99 20.85,53.99 21.49,54.62 21.53,54.62 29.83,46.32 RL1.9 29.95,44.67 J2.9 U1.32
DAC: length 137
  Top Layer w0.254: J4.1 3.56,19.89 3.56,20.52 2.92,21.15 2.92,26.32 2.12,27.13 2.12,30.76 12.67,41.32 12.67,42.73 13.68,43.74 16.53,43.74 16.57,43.7 17.59,43.7 18.22,43.07 18.22,42.17 17.59,41.54 16.7,41.54 16.07,42.17 14.53,42.17 8.59,36.23 8.59,35.38 10.12,33.85 10.12,33.52 13.76,29.88 20.13,29.88 23.36,26.66 23.36,21.97 25.44,19.89 C17.2 33.74,19.89 36.03,17.6 36.03,14.55 35.57,14.09 35.57,6.67 40.66,1.58 42.39,1.58 42.56,1.74 42.56,7.51 36.74,13.33 36.74,18.87 37.76,19.89 39.71,19.89 C15.2
  Bottom Layer w0.254: C14.2 40,19.55 C15.2
DACL: length 23.9
  Inner1 w0.254: v2(19.32,8.47) 25.44,14.59 26.03,14.59 26.14,14.49 32.03,14.49 32.75,13.77 35.75,13.77 36.58,14.59 C15.1
DACR: length 22
  Inner1 w0.254: v2(18.67,8.47) 18.79,8.59 18.79,9.3 26.14,16.65 30.2,16.65 32.36,18.81 33.43,18.81 34.06,19.44 34.06,19.79 34.11,19.85 C14.1
E: length 87.6
  Top Layer w0.254: RL4.8 27.25,72.92 27.25,75.21 27.43,75.39 35.43,75.39 37.47,77.42 40.46,77.42 41.28,78.24 41.28,79.96 48.54,87.23 48.54,89.41 47.93,90.02 47.07,90.02 46.46,89.41 46.46,88.55 47.14,87.86 47.14,86.84 40.39,80.08 40.38,80.08 40.56,79.9 40.56,79.5 V6.1 39.62,79.07 39.62,80.59 34.8,85.42 12.95,85.42 9.02,81.48 9.02,78.69
F: length 59.9
  Top Layer w0.254: V6.10 43.89,88.98 42.85,87.94 41.99,87.94 41.38,88.55 41.38,89.38 40.51,90.25 19.1,90.25 18.14,89.28 18.14,88.85 18.03,88.75 18.03,88.27 17.22,87.45 16.06,87.45 14.66,88.85 14.1,88.85
  Bottom Layer w0.254: RL4.7 27.05,71.19 28.13,72.27 28.13,74.82 14.1,88.85
G: length 53.1
  Top Layer w0.254: RL4.6 24.62,67.64 24.56,67.59 24.31,67.59 24.13,67.77 24.13,73.74 24.11,73.76 24.11,75.41 23.39,76.12 21.74,76.12 19.18,78.69
  Bottom Layer w0.254: V6.5 51.08,79.86 53.01,79.86 53.62,79.25 53.62,78.39 48.14,72.9 42.66,72.9 38.47,68.71 32.51,68.71 31.44,67.64 RL4.6
H: length 64.7
  Top Layer w0.254: 14.1,78.69 17.02,75.77 23.24,75.77 23.75,75.26 23.75,65.61 23.93,65.43 26.72,65.43 RL4.5
  Inner1 w0.254: 14.1,78.69 13.06,77.65 11.13,77.65 10.52,78.26 10.52,79.12 11.48,80.09 42.62,80.09 43.89,78.82 V6.3
IO1: length 14.8
  Inner1 w0.254: J4.2 14.77,10.45 v2(14.77,8.47)
IO2: length 18.5
  Bottom Layer w0.254: v2(14.12,8.47) 14.24,8.59 14.24,8.69 14.31,8.76 14.31,9.34 14.63,9.66 14.63,10.17 13.23,11.57 9.99,11.57 9.58,11.16 9.58,10.9 9.27,10.59 8.83,10.59 8.51,10.9 8.51,11.2 8.16,11.56 8.16,12.29 8.66,12.8 8.66,14.52 8.76,14.61 8.76,19 J4.3
IO3: length 9.2
  Top Layer w0.127: v2(13.35,13.06) 13.31,13.09 13.31,13.09 12.95,12.74 11.7,12.74 11.39,13.05 11.39,15.77 10.54,16.61 10.54,18.49 10.8,18.75 J4.4
IO4: length 5
  Top Layer w0.254: J4.5 14.27,18.57 v2(14.27,17.09)
  Inner1 w0.254: v2(14.27,17.09) 14.27,15.11 v2(14.1,14.94)
P10: length 55
  Top Layer w0.254: LED11.1 57.25,24.23 RL2.9 57.13,24.35 J1.1 U1.1
  Bottom Layer w0.254: RL2.9 64.1,24.33 65.09,25.32 66.48,25.32 69.02,27.86 69.92,27.86 87.84,45.79 89.56,45.79 90.31,46.54 90.31,47.89 Q2.1
P11: length 8.9
  Top Layer w0.254: U1.2 J1.2 57.13,26.89 RL2.8 59.97,26.87 LED12.1
P12: length 8.9
  Top Layer w0.254: LED13.1 59.99,29.41 RL2.7 57.13,29.43 J1.3 U1.3
P13: length 8.9
  Top Layer w0.254: U1.4 J1.4 57.13,31.97 RL2.6 60,31.95 LED14.1
P14: length 8.9
  Top Layer w0.254: U1.5 J1.5 57.13,34.51 RL2.5 60.02,34.49 LED15.1
P15/MOSI: length 8.9
  Top Layer w0.254: LED16.1 60.04,37.03 RL2.4 57.13,37.05 J1.6 U1.6
P16/MISO: length 8.9
  Top Layer w0.254: U1.7 J1.7 57.13,39.59 RL2.3 60.05,39.57 LED17.1
P17/SCK: length 8.9
  Top Layer w0.254: LED18.1 60.03,42.11 RL2.2 57.13,42.13 J1.8 U1.8
P20/SDA: length 2.9
  Top Layer w0.254: U1.21 J2.20
P21/SCL: length 2.9
  Top Layer w0.254: U1.22 J2.19
P22/18B20: length 2.9
  Top Layer w0.254: U1.23 J2.18
P23: length 8
  Top Layer w0.254: J2.17 U1.24
  Bottom Layer w0.254: R10.1 36.19,64.72 U1.24
P24: length 2.9
  Top Layer w0.254: J2.16 U1.25
P25: length 2.9
  Top Layer w0.254: U1.26 J2.15
P26/DULA: length 26.8
  Top Layer w0.254: J2.14 U1.27
  Bottom Layer w0.254: v1(13.72,54.4) 18.61,54.4 19.15,53.86 30.37,53.86 32.51,56.01 34.56,56.01 U1.27
P27/WELA: length 42.4
  Top Layer w0.254: J2.13 U1.28
  Bottom Layer w0.254: J2.13 33.82,55.65 34.71,55.65 35.35,56.29 36.37,56.29 37,56.92 37,57.82 36.27,58.55 29.06,58.55 29.06,64.62 27.5,66.18 20.8,66.18 20.29,66.69 19.49,66.69 18.86,67.32 18.86,68.12 v1(13.72,73.26)
P30/TXD: length 212.3
  Top Layer w0.254: S9.1 85.5,18.77 83.41,20.86 80.39,20.86 79.6,20.07 79.6,19.21 79.58,19.19 79.58,18.89 79.45,18.77 S8.1 73.85,18.77 71.76,20.86 68.74,20.86 67.89,20.02 67.89,19.72 66.94,18.77 S7.1 62.2,18.77 60.11,20.86 57.09,20.86 56.3,20.07 56.3,19.59 56.21,19.49 56.21,19.2 55.78,18.77 S6.1 50.6,22.92 50.08,23.44 50.08,45.12 50.6,45.63 50.6,46.64 U1.10 J1.10
  Inner1 w0.254: U1.10 51.16,46.2 52.24,45.12 52.24,41.68 51.61,41.05 49.31,41.05 37.36,29.1 37.36,28.84 36.52,28 35.5,28 34.84,27.34 34.84,24 29.66,18.81 27.07,18.81 v2(19.51,11.25) ; v1(80.43,84.24) 78.29,82.1 69.38,82.1 68.72,81.44 68.72,80.51 69.38,79.85 70.32,79.85 70.98,80.51 78.63,80.51 78.63,65.38 83.67,60.34 83.67,59.45 83.19,58.96 D1.2 77.07,47.21 J1.10
P31/RXD: length 210.6
  Top Layer w0.254: J1.11 U1.11 50.6,49.19 50.6,48.17 49.37,46.94 49.37,17.9 50.6,16.67 S10.1 55.55,13.87 56.56,14.89 56.56,19.35 56.66,19.44 56.66,19.93 57.24,20.51 59.96,20.51 60.54,19.93 60.54,15.58 S11.1 67.23,13.87 68.25,14.89 68.25,19.87 68.89,20.51 71.61,20.51 72.19,19.93 72.19,15.58 S12.1 78.92,13.87 79.93,14.89 79.93,19.04 79.96,19.06 79.96,19.93 80.54,20.51 83.26,20.51 83.84,19.93 83.84,15.58 S13.1
  Inner1 w0.254: U1.11 50.84,49.42 50.84,48.41 50.08,47.66 50.08,45.77 49.76,45.45 49.76,42.39 37,29.64 37,28.98 36.37,28.35 35.2,28.35 34.18,27.34 34.18,26.4 33.49,25.71 32.51,25.71 32.19,26.04 31.84,26.04 31.5,25.69 31.5,24.65 30.91,24.06 30.91,23.56 23.96,16.61 v2(23.96,16.46)
  Bottom Layer w0.254: R7.1 85.2,89.13 82.29,89.13 78.67,85.51 78.67,81.63 78.19,81.15 76.69,81.15 60.49,64.95 60.49,57.03 54.08,50.62 J1.11
P32/INT0: length 143.3
  Top Layer w0.254: S17.1 83.48,10.91 83.48,19.78 83.11,20.15 80.69,20.15 80.31,19.78 80.31,18.92 80.29,18.89 80.29,10.85 78.29,8.85 S16.1 71.83,10.91 71.83,19.78 71.46,20.15 69.03,20.15 68.6,19.72 68.6,10.82 66.64,8.85 S15.1 60.18,10.91 60.18,19.78 59.81,20.15 57.38,20.15 57.01,19.78 57.01,19.29 56.92,19.2 56.92,8.86 56.91,8.85 S14.1 50.6,11.78 49.01,13.36 49.01,49.13 50.6,50.71 50.6,51.73 U1.12 J1.12
P33/INT1: length 170
  Top Layer w0.254: J1.13 U1.13 50.6,54.27 50.6,53.25 48.66,51.31 48.66,8.7 50.6,6.75 S18.1 52.52,3.96 57.28,8.71 57.28,19.05 57.37,19.14 57.37,19.63 57.53,19.8 59.66,19.8 59.83,19.63 59.83,8.84 62.25,6.42 S19.1 68.96,10.67 68.96,19.57 69.18,19.8 71.31,19.8 71.48,19.63 71.48,6.38 S20.1 80.65,10.7 80.65,18.75 80.67,18.77 80.67,19.63 80.83,19.8 82.96,19.8 83.13,19.63 83.13,8.97 85.55,6.55 S21.1
P34/LCDEN: length 83.4
  Top Layer w0.254: J1.14 U1.14 48.9,55.1 48.9,52.05 48.3,51.46 48.3,4.16 49.53,2.93 51.66,2.93 52.34,3.6 52.67,3.6 53.02,3.96 S18.2 S14.2 S10.2 S6.2
P35/RS: length 98.5
  Top Layer w0.254: J1.15 U1.15 48.39,57.13 48.39,52.05 47.94,51.61 47.94,4.01 48.39,3.57 48.39,3.5 49.32,2.57 62.96,2.57 64.34,3.96 S19.2 S15.2 S11.2 S7.2
P36/WR: length 113.6
  Top Layer w0.254: S8.2 S12.2 S16.2 S20.2 80.16,2.21 49.17,2.21 48.52,2.87 48.51,2.87 48.33,3.05 48.33,3.05 47.59,3.8 47.59,56.84 48.33,57.59 48.33,59.62 U1.16 J1.16
P37/RD: length 128.6
  Top Layer w0.254: J1.17 U1.17 47.57,61.4 47.57,57.33 47.23,56.99 47.23,3.65 47.57,3.31 47.57,3.3 47.75,3.12 47.76,3.12 47.98,2.91 47.98,2.9 49.02,1.86 85.55,1.86 87.64,3.96 S21.2 S17.2 S13.2 S9.2
P44: length 2.9
  Top Layer w0.254: J2.12 U1.29
P45: length 2.9
  Top Layer w0.254: J2.11 U1.30
RST: length 124.6
  Top Layer w0.254: J1.9 U1.9
  Bottom Layer w0.254: J1.9 55.17,44.67 56.23,45.73 58.07,45.73 59.13,44.67 77.58,44.67 R6.1 84.82,51.91 90.13,51.91 91.22,50.82 92.7,50.82 94.07,52.19 96.46,52.19 98.28,54.01 98.28,66.63 93.77,71.15 93.77,72.9 93.38,73.3 84.76,73.3 84.45,73.6 v1(84.45,77.17) ; v1(41.53,10.81) 41.53,35.04 U1.9
RTCVDD: length 58.3
  Bottom Layer w0.254: C11.1 5.36,22.95 5.36,20.61 4.69,19.93 4.69,19.08 6.39,17.38 6.39,15.25 4.91,13.77 4.91,8.48 5.29,8.1 5.29,4.15 4.69,3.55 4.69,2.7 5.29,2.09 6.14,2.09 6.74,2.7 6.74,3.55 6.72,3.57 6.72,9.23 6.3,9.65 6.3,12.6 6.72,13.02 6.72,14.58 7.1,14.96 7.1,19.81 7.83,20.54 8.68,20.54 9.28,19.93 9.28,19.16 12.88,15.57 17.16,15.57 17.83,14.9 17.83,14.32 17.91,14.25 17.91,14.15 v2(18.02,14.03)
  vias: v1(3.94,22.94)
RX2: length 13.9
  Top Layer w0.254: J3.3 15.88,3.63 16.05,3.8 16.05,10.74 R13.2
  Bottom Layer w0.254: MP3-IC.7 15.42,3.58 J3.3
SD_CLK/IO7: length 9.2
  Top Layer w0.127: v2(14.79,13.56) 14.79,14.02 14.95,14.19 14.95,14.23 15.23,14.5 15.27,14.5 16.33,15.57 17.27,15.57 17.4,15.7 17.68,15.7 18.11,16.13 18.11,16.53 20.95,19.38 J4.8
SD_CMD/IO6: length 18.5
  Top Layer w0.127: J4.7 18.59,19.51 19.86,20.78 21.72,20.78 22.48,20.02 22.48,18.87 21.34,17.73 20.32,17.73 19.98,17.39 19.98,13.56 19.2,12.78 16.45,12.78 15.55,13.67 15.55,13.91 v2(15.42,14.03)
SD_DAT/IO5: length 16.5
  Top Layer w0.127: J4.6 17.05,19.51 18.02,18.54 18.81,18.54 19.38,19.11 19.38,19.3 20.55,20.47 21.36,20.47 21.92,19.91 21.92,19.11 21.36,18.54 20.58,18.54 18.34,16.3 18.34,16.03 17.77,15.47 17.5,15.47 16.07,14.05 v2(16.07,14.03)
SPI-CLK: length 48.2
  Top Layer w0.127: v2(12.82,14.03) 12.64,14.21 12.64,14.23 12.57,14.3 12.57,18.4 12.01,18.96 12.01,19.91 11.24,20.68 11.24,25.99 10.32,26.91 10.32,27.04 10.41,27.13 10.85,27.13 10.88,27.15 10.88,28.37 11.74,29.23 19.86,29.23 22.71,26.39 22.71,9.57 23.05,9.23 23.44,9.23 23.91,9.7 v2(24.51,9.7)
SPI-CS: length 22
  Bottom Layer w0.254: SPI-Flash.1 26.38,1.97 26.38,1.59 26.03,1.24 13.77,1.24 12.31,2.7 12.31,8.34 v2(12.17,8.47)
SPI-DI: length 10.2
  Top Layer w0.254: R17.1 25.52,10.19 25.25,9.92 25.25,5.82 25.52,5.55 25.52,2.9 v2(25.78,2.64)
SPI-DIO:
  vias: v2(12.17,14.03)
SPI-DO: length 3.1
  Top Layer w0.254: R17.2 24.01,10.47 v2(23.24,9.7)
SPK+: length 52.7
  Top Layer w0.254: SPK1.1 16.38,43.38 15.24,43.38 8.23,36.37 8.23,33.03 7.6,32.4 6.16,32.4 3.28,29.52 3.28,29.09 2.47,28.29 2.47,27.27 3.28,26.47 3.28,21.3 4.52,20.05 4.52,5.56 3.17,4.21 J3.8
  Bottom Layer w0.254: 功放.8 16.27,42.51 16.38,42.62 SPK1.1
SPK-: length 57.8
  Top Layer w0.127: R16.2 12.69,5.79 11.19,4.29 11.19,4.09 11.76,3.52 11.76,2.72 11.63,2.6 11.63,1.96 11,1.33 7.45,1.33 5.72,3.07 J3.7
  Bottom Layer w0.254: J3.7 5.72,8.18 5.27,8.62 5.27,13.63 6.74,15.1 6.74,19.93 5.72,20.96 5.72,37.56 功放.5 10.03,42.51 9.79,42.75 7.87,42.75 SPK1.2
TX2: length 34.1
  Top Layer w0.254: J3.4 15.67,5.46 15.67,12.22 15.84,12.38 17.27,12.38 17.44,12.22 17.44,10.29 17.96,9.76 19.97,9.76 21,10.79 R12.2
  Bottom Layer w0.254: J3.4 14.42,3.12 15.45,2.09 16.3,2.09 16.9,2.7 16.9,3.55 16.07,4.38 16.07,8.47
UD+: length 12.5
  Inner1 w0.254: v1(83.26,83.13) 92.13,83.13 v2(94.67,85.67)
UD-: length 12.8
  Inner1 w0.254: v2(94.79,85.02) 91.63,81.86 v1(83.26,81.86)
USB-DM: length 10.6
  Bottom Layer w0.254: v2(9.05,11.12) 9.05,11.17 8.51,11.7 8.51,12.15 8.89,12.52 15.89,12.52 16.72,13.36 v2(16.72,14.03)
USB-DP: length 9.6
  Bottom Layer w0.254: v2(17.37,14.03) 17.26,13.91 17.26,13.81 17.18,13.74 17.18,13.17 15.94,11.93 v2(9.05,11.93)
VCOM: length 10.9
  Bottom Layer w0.254: v2(18.67,14.03) 18.67,18.31 19.44,19.08 19.44,19.93 18.67,20.7 18.67,22.77 C10.1
VMCU: length 64.2
  Top Layer w0.254: C12.2 16.55,27.64 15.47,26.56 14.58,26.56 13.5,27.64 13.24,27.64 13.75,27.13 13.75,26.75 15.43,25.06 15.43,20.52 14.85,19.93 14.85,19.08 15.45,18.48 15.63,18.48 15.64,18.47 15.64,18.33 16.17,17.81 16.17,15.85 14.25,13.94 14.25,13.25 14.48,13.03 15.06,13.03 15.26,12.83 15.26,12.22 15.05,12.01 C19.2 ; C19.2 14.54,12.01 ; C19.2 14.67,10.4 C18.2
  Inner1 w0.254: D2.1 12.35,36.8 12.47,36.92 12.47,41.98 v2(11.94,42.51) ; v2(17.37,8.47) 17.37,11.33 19.86,13.81 19.86,27.47 C12.2
VPP: length 20
  Top Layer w0.127: J3.1 19.87,3.12 18.51,1.76 12.66,1.76 12.06,2.36 12.06,2.49 12.14,2.56 12.14,3.62 13.46,4.94 13.46,7.5 12.95,8 11.98,8 11.7,8.28 11.7,8.67 11.98,8.94 13.02,8.94 13.31,8.65 13.31,8.63 v2(13.47,8.47)
WE1: length 17.9
  Top Layer w0.254: U8.19 3.49,73.33 3.49,80.98 8.25,85.74 8.25,88.09 9.02,88.85
WE2: length 25.5
  Top Layer w0.254: U8.18 4.83,81.8 10.52,87.49 10.52,89.28 11.48,90.25 15.23,90.25 16.63,88.85 V5.9
WE3: length 25
  Top Layer w0.254: 19.18,88.85 19.12,88.85 17.08,86.82 10.34,86.82 6.03,82.5 6.03,73.33 U8.17
WE4: length 23
  Top Layer w0.254: U8.16 7.37,73.64 7.42,73.7 7.42,75.62 10.06,78.26 10.06,80.19 11.25,81.38 12.27,81.38 13.03,82.14 18.97,82.14 20.01,81.1 21.08,81.1 21.72,80.47 V5.6
WE5: length 49.2
  Top Layer w0.254: 8.54,73.36 8.54,73 7.94,72.41 7.94,72.14 7.61,71.8 7.13,71.8 6.79,72.14 6.79,74.38 7.07,74.66 7.07,75.77 8.59,77.29 8.59,77.65 7.98,78.26 7.98,79.12 8.66,79.81 8.66,81.63 12.81,85.78 18.03,85.78 20.68,88.42 20.68,89.28 21.29,89.89 22.51,89.89 23.42,88.98 V6.12
WE6: length 53.1
  Top Layer w0.254: V6.9 47.5,86.69 40.92,80.11 40.92,78.39 40.31,77.78 36.3,77.78 35,76.48 21.89,76.48 20.22,78.15 20.22,79.12 19.25,80.09 11.48,80.09 10.52,79.12 10.52,77.65 10.29,77.42 10.29,73.64 U8.14
WE7: length 67
  Bottom Layer w0.254: V6.8 48.97,88.98 47.93,87.94 41.99,87.94 40.92,89 40.92,89.41 40.31,90.02 21.41,90.02 20.68,89.28 20.68,88.42 20.07,87.81 16.14,87.81 15.49,88.46 15.49,89.43 14.68,90.25 11.48,90.25 10.52,89.28 10.52,88.42 11.13,87.81 11.13,85.67 17.68,79.12 17.68,78.26 17.07,77.65 15.56,77.65 v1(11.18,73.26)
WE8: length 46.8
  Bottom Layer w0.254: v1(12.45,73.26) 12.89,73.26 13.47,73.84 14.88,73.84 19.62,69.1 27.83,69.1 32.51,73.79 36.27,73.79 36.8,73.26 47.02,73.26 V6.6
XTL1: length 27
  Top Layer w0.254: U1.19 51.16,70.85 49.6,72.41 49.6,72.67 49.78,72.85 49.87,72.85 50.82,73.79 54.57,73.79 55.77,72.59 X2.2
  Bottom Layer w0.254: X2.2 62.14,72.59 63.17,73.62 66.56,73.62 C8.2
XTL2: length 106.5
  Top Layer w0.254: U1.18 49.66,69.04 49.66,71.86 49.25,72.27 49.25,72.81 50.58,74.15 59.06,74.15 60.61,72.59 X2.1
  Bottom Layer w0.254: X2.1 64.03,69.97 58.13,64.06 58.13,63.09 58.82,62.4 58.82,61.42 55.26,57.86 55.26,54.16 54.57,53.47 53.6,53.47 52.91,52.78 52.91,51.8 53.6,51.11 53.6,50.93 52.91,50.24 52.91,49.26 53.6,48.57 54.57,48.57 55.26,49.26 55.26,51.3 60.84,56.88 60.84,64.8 68.64,72.59 77.74,72.59 79.95,70.39 83.61,70.39 C9.2
$1N5616: length 18.5
  Inner1 w0.254: RL3.1 19.27,54.4 17.24,54.4 15.01,52.17 6.23,52.17 4,54.4 v1(3.56,54.4)
$1N5618: length 18
  Inner1 w0.254: v1(4.83,54.4) 6.7,52.53 14.86,52.53 RL3.2
$1N5620: length 18.7
  Inner1 w0.254: RL3.3 17.4,57.61 8.05,57.61 8.05,54.26 7.61,53.82 7.12,53.82 6.54,54.4 v1(6.1,54.4)
$1N5622: length 17.8
  Inner1 w0.254: RL3.4 15.24,57.99 7.87,57.99 7.69,57.81 7.69,54.73 v1(7.37,54.4)
$1N5624: length 22.8
  Bottom Layer w0.254: RL4.1 26.51,54.4 22.6,54.4 20.85,56.15 13.76,56.15 13.14,55.52 13.14,54.65 13.13,54.64 13.13,54.4 13.03,54.3 13.03,54.16 13.02,54.15 13.02,53.28 12.69,52.94 9.67,52.94 9.33,53.28 9.33,53.71 v1(8.64,54.4)
$1N5626: length 29.4
  Bottom Layer w0.254: v1(9.91,54.4) 10.6,55.09 10.6,55.52 19.07,64 27.65,64 28.49,63.15 28.49,58.92 RL4.2
$1N5628: length 25.8
  Bottom Layer w0.254: v1(11.18,54.4) 11.11,54.47 11.11,55.53 15.28,59.7 18.86,59.7 19.49,59.07 20.39,59.07 24.96,63.64 27.5,63.64 28.13,63.01 28.13,62.11 27.05,61.03 RL4.3
$1N5630: length 19.3
  Bottom Layer w0.254: v1(12.45,54.4) 12.45,55.96 13.4,56.91 19.11,56.91 19.49,56.53 20.39,56.53 21.02,57.16 21.02,57.29 26.29,62.56 RL4.4
$1N8009: length 9.2
  Top Layer w0.254: F1.2 97.37,63.59 SW1.3
$1N8347: length 104.4
  Top Layer w0.254: v1(77.52,88.21) 78.31,87.42 82.2,87.42 85.67,83.95 86.15,83.95 89.62,87.42 LED9.2 91.62,87.42 93.74,85.3 93.74,84.71 93.9,84.55 94.5,84.55 USB1.1 92.37,82.08 92.37,79.35 93.41,78.31 93.41,77.45 92.37,76.41 SW1.1 92.37,66.44 94,64.81 94,48.77 87.75,42.52 87.75,42.42 EC2.1
  Bottom Layer w0.254: C1.2 86.85,62.03 89.72,64.91 89.72,65.8 89.09,66.43 89.09,68.6 SW1.1
$1N8729: length 59.7
  Inner1 w0.254: D1.1 95.91,57.35 95.91,78.31 95.88,78.34 95.88,86.69 95.71,86.87 83.71,86.87 v1(83.64,86.94)
$1N8914: length 50.5
  Inner1 w0.254: NOREF.1 78.27,67.72 78.27,79.14 77.25,80.15 71.13,80.15 70.47,79.49 69.23,79.49 68.57,80.15 68.08,80.15 67.78,79.85 66.84,79.85 66.18,80.51 66.18,81.44 66.84,82.1 68.81,82.1 71.79,85.09 79.09,85.09 v1(80.44,86.44)
$1N9036: length 8.4
  Bottom Layer w0.254: R7.2 85.83,87.03 84.09,88.77 82.44,88.77 82.11,88.45 82.11,87.98 82.44,87.66 82.44,87.5 82.11,87.18 82.11,86.71 83.15,85.67 U10.3
$1N9212: length 27
  Bottom Layer w0.254: U10.4 83.64,84.4 84.36,83.69 84.47,83.69 85.36,82.81 85.72,82.81 85.9,82.63 85.9,82.37 85.82,82.29 85.82,75.61 85.64,75.43 85.64,74.1 85.82,73.92 85.82,73.85 85.98,73.68 89.17,73.68 89.34,73.85 89.34,75.18 88.88,75.63 88.88,83.88 89.1,84.1 C2.2
$1N9264: length 90
  Bottom Layer w0.254: U10.14 77.09,85.67 69.28,77.87 69.28,76.84 66.41,73.98 59.09,73.98 57.77,72.67 57.77,61.75 54.57,58.55 53.6,58.55 52.55,57.5 52.55,47.08 53.6,46.03 54.57,46.03 61.2,52.66 61.2,64.65 65.33,68.78 J0.1
$1N9436: length 3.3
  Top Layer w0.254: LED11.2 65.52,24.23 RL6.8
$1N9463: length 3.3
  Top Layer w0.254: RL6.7 62.26,26.78 LED12.2
$1N9490: length 3.3
  Top Layer w0.254: LED13.2 65.51,29.34 RL6.6
$1N9517: length 3.3
  Top Layer w0.254: RL6.5 65.49,31.9 LED14.2
$1N9544: length 15
  Top Layer w0.254: RL7.8 69.47,25.25 67.21,27.52 67.21,31.71 65.98,32.94 65.09,32.94 64.45,32.31 64.41,32.31 LED15.2
$1N9571: length 15
  Top Layer w0.254: LED16.2 62.51,36.76 62.88,36.76 63.31,36.33 63.31,36.24 63.94,35.61 64.04,35.61 64.42,35.23 64.83,35.23 65.09,35.48 65.98,35.48 66.61,34.85 66.61,33.45 67.56,32.5 67.56,28.3 69.09,26.78 RL7.7
$1N9598: length 15.3
  Top Layer w0.254: LED17.2 62.53,39.29 62.93,39.29 64.07,38.15 65.85,38.15 66.61,37.39 66.61,36.12 67.37,35.35 67.37,33.19 67.92,32.64 67.92,29.6 68.2,29.32 RL7.6
$1N9625: length 14.7
  Top Layer w0.254: LED18.2 63.65,40.69 65.85,40.69 66.61,39.93 66.61,38.53 67.5,37.64 67.5,35.73 67.73,35.5 67.73,33.34 68.28,32.79 68.28,32.67 69.09,31.86 RL7.5
$1N9867: length 78.2
  Top Layer w0.254: RL6.4 65.06,34.87 64.27,34.87 63.89,35.25 63.79,35.25 62.94,36.11 61.64,36.11 61.48,36.27 61.48,37.75 61.64,37.92 62.87,37.92 63.85,36.94 RL6.3 64.68,37.79 63.92,37.79 63.05,38.67 61.64,38.67 61.48,38.83 61.48,40.31 61.64,40.47 62.87,40.47 63.87,39.48 RL6.2 64.68,40.33 63.51,40.33 62.66,41.18 61.64,41.18 61.48,41.34 61.48,42.83 61.64,42.99 62.87,42.99 63.84,42.02 RL6.1 ; RL6.1 RL7.1 RL7.2 RL7.3 RL7.4 ; RL6.1 61.05,46.5 60.99,46.5 58.07,43.57 56.23,43.57 56.07,43.74 56.07,45.57 56.23,45.73 56.8,45.73 59.31,48.24 J9.1
$1N10308: length 7.2
  Bottom Layer w0.254: 43.9,64.72 43.9,58.91 Q1.1
$1N10336: length 27.2
  Inner1 w0.254: v1(40.91,56.97) 50.04,56.97 50.82,56.19 54.57,56.19 55.35,56.97 66.92,56.97 U11.1
$1N10560: length 9.6
  Bottom Layer w0.254: Q2.3 96.65,47.81 K1.1
$1N10700: length 32.6
  Bottom Layer w0.254: K1.10 89.95,47.99 89.95,48.03 91.06,49.14 91.06,50.01 91.22,50.17 92.7,50.17 92.87,50.01 92.87,49.08 92.7,48.92 91.84,48.92 90.66,47.74 90.66,44.04 96.03,38.67 96.03,32.78 95.63,32.37 电磁锁.2
$1N11856: length 2.9
  Top Layer w0.254: R14.2 23.57,6.02 23.97,6.42
$1N12078: length 28.5
  Bottom Layer w0.254: v2(11.94,37.14) v2(13.21,37.14) 13.88,36.47 13.88,36.28 14.23,35.93 14.42,35.93 26.58,23.77 C16.1
$1N12197: length 23.8
  Top Layer w0.254: v1(9.53,33.6) 13.61,29.53 19.98,29.53 23,26.51 23,20.14 23.25,19.89 C17.1
$1N12208: length 48
  Inner1 w0.254: v2(10.67,37.14) 10.67,24.17 11.11,23.72 11.11,21.28 9.77,19.93 9.77,19.08 8.86,18.18 7.65,18.18 6.74,19.08 6.74,19.93 6.14,20.54 5.29,20.54 4.69,19.93 4.69,19.08 11.28,12.48 11.28,8.1 11.8,7.58 12.79,7.58 v2(14.2,6.17)
  Bottom Layer w0.254: R15.2 11.04,36.77 v2(10.67,37.14)

## Copper pours and planes (outline as drawn; the poured copper is in the pictures)
GND on Top Layer: 0,91.26 100,91.26 100,0 0,0
GND on Bottom Layer: 0,91.26 100,91.26 100,0 0,0

## Text on the board
Bottom Silkscreen Layer: P0 | P1 | P3 | P2.3 | P3.0 | P3.1 | TXD | RXD | 矩阵键盘 | 流水灯 | 数码管 | 蜂鸣器
Top Silkscreen Layer: VCC | P44 | P46 | P20 | P27 | P07 | P00 | GND | P37 | P30 | RST | P17 | P10 | ~
